# Altium project DAC_TEST.PrjPcb
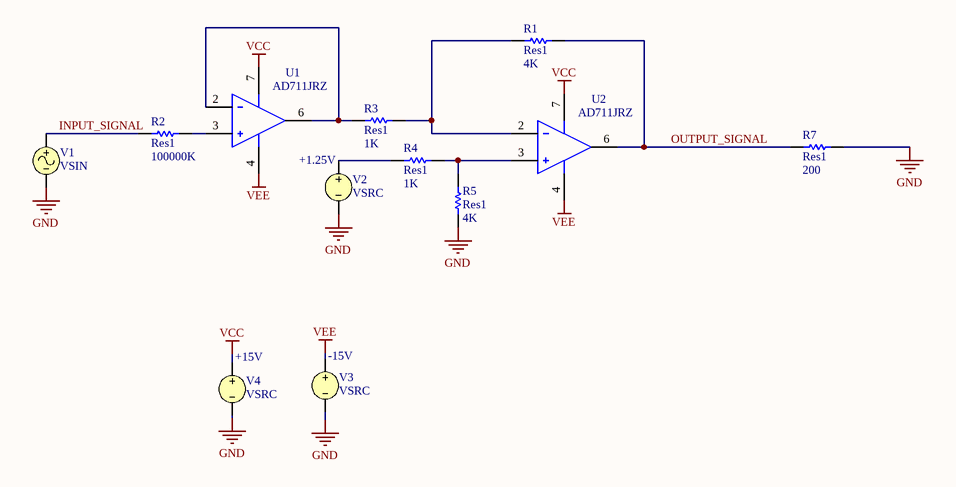
[diagram p0: DAC_TEST.SchDoc]
1 sheet, 12 parts. Net scope: global (net labels, ports and power ports of the same name join across sheets).

## Sheet DAC_TEST.SchDoc
size A4

### Parts
R1  Res1  value 4K  [AXIAL-0.3]
R2  Res1  value 100000K  [AXIAL-0.3]
R3  Res1  value 1K  [AXIAL-0.3]
R4  Res1  value 1K  [AXIAL-0.3]
R5  Res1  value 4K  [AXIAL-0.3]
R7  Res1  value 200  [AXIAL-0.3]
U1  AD711JRZ
U2  AD711JRZ
V1  VSIN
V2  VSRC  value +1.25V
V3  VSRC  value -15V
V4  VSRC  value +15V

### Nets
GND: R5.1 R7.2 V1.2 V2.2 V3.2 V4.2
VCC: U1.7(VCC) U2.7(VCC) V4.1
VEE: U1.4(VEE) U2.4(VEE) V3.1
INPUT_SIGNAL: R2.1 V1.1
OUTPUT_SIGNAL: R1.2 R7.1 U2.6(OUT)
NetR1_1: R1.1 R3.2 U2.2(INV)
NetR2_2: R2.2 U1.3(NONINV)
NetR3_1: R3.1 U1.2(INV) U1.6(OUT)
NetR4_1: R4.1 V2.1
NetR4_2: R4.2 R5.2 U2.3(NONINV)

### Library data of the parts
R1-R5 R7 = Res1: Resistor; Published: 8-Jun-2000; LatestRevisionDate: 17-Jul-2002; LatestRevisionNote: Re-released for DXP Platform.; PackageReference: AXIAL-0.3; Publisher: Altium Limited; PackageDescription: Axial Device, Thru-Hole; 2 Leads; 0.3 in Pin Spacing
U1 U2 = AD711JRZ: Operational Amplifier
V1 = VSIN: Sinusoidal Voltage Source; Note: PCB Footprint - Not required; Published: 8-Jun-2000; LatestRevisionDate: 15-Nov-2004; LatestRevisionNote: Corrected Netlist.; PackageReference: Not Applicable; Publisher: Altium Limited
V2-V4 = VSRC: Voltage Source; Note: PCB Footprint - Not required; Published: 8-Jun-2000; LatestRevisionDate: 17-Jul-2002; LatestRevisionNote: Re-released for DXP Platform.; PackageReference: Not Applicable; Publisher: Altium Limited